# EAGLE design xmega32devboard (EAGLE 7.2.0)
CNAME: ATxmega32D4 Development Board; CREVISION: 0.2; DESIGNER: Dru / RNDC
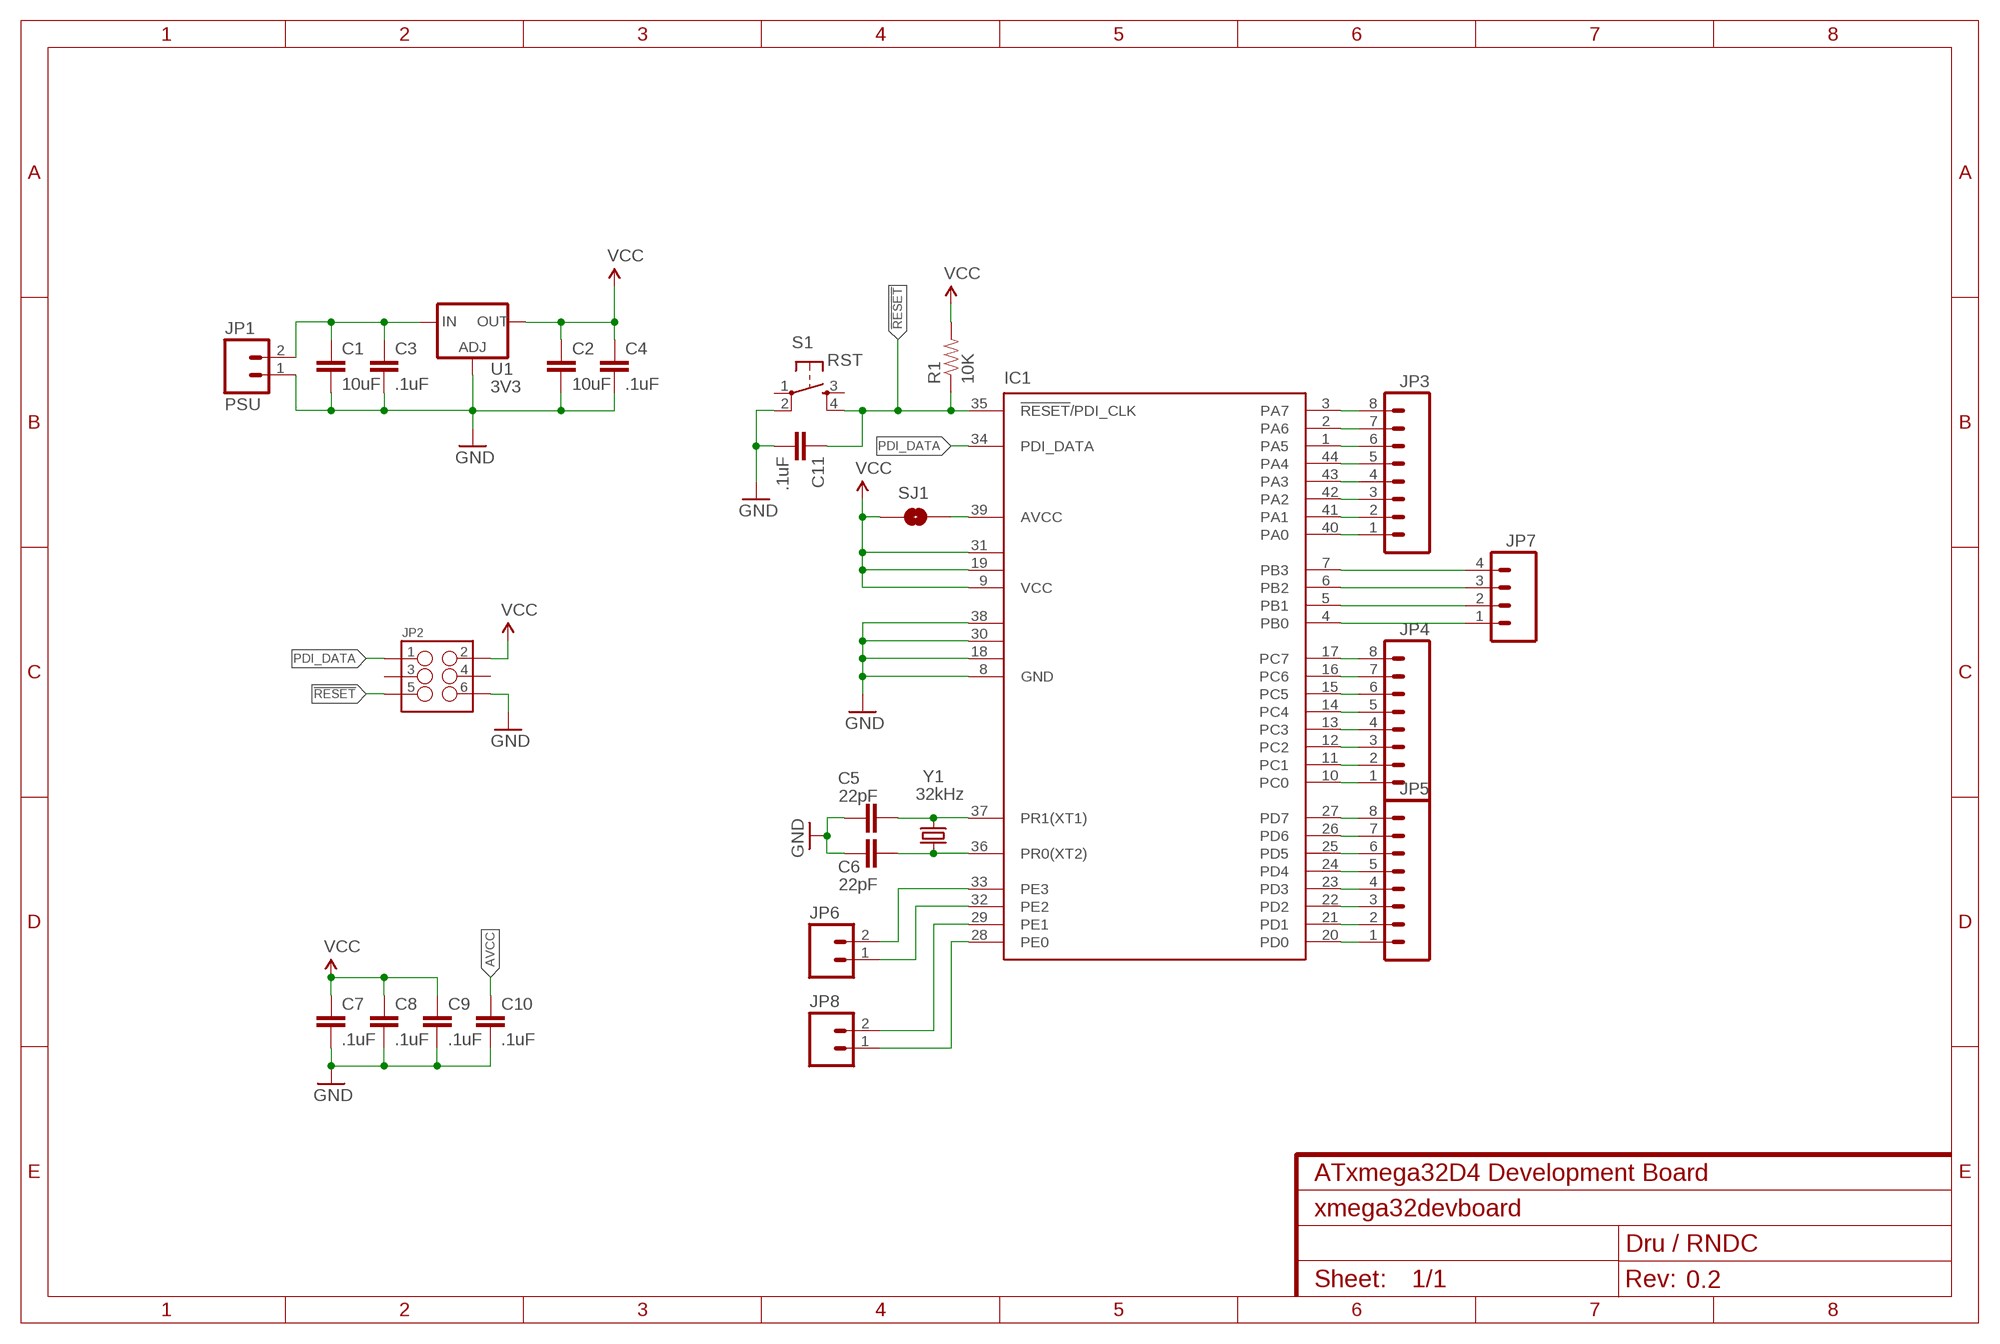
[diagram p0: schematic, sheet 1]

## Parts
C1  10uF  CAP0603-CAP  [0603-CAP]
C2  10uF  CAP0603-CAP  [0603-CAP]
C3  .1uF  CAP0805  [0805]
C4  .1uF  CAP0805  [0805]
C5  22pF  CAP0805  [0805]
C6  22pF  CAP0805  [0805]
C7  .1uF  CAP0805  [0805]
C8  .1uF  CAP0805  [0805]
C9  .1uF  CAP0805  [0805]
C10  .1uF  CAP0805  [0805]
C11  .1uF  CAP0805  [0805]
IC1  XMEGA16A4A  [TQFP44]
JP1  PSU  M02PTH  [1X02]
JP2  M03X2NO_SILK  [2X3-NS]
JP3  M081X08  [1X08]
JP4  M081X08  [1X08]
JP5  M081X08  [1X08]
JP6  M02PTH  [1X02]
JP7  M04PTH  [1X04]
JP8  M02PTH  [1X02]
R1  10K  RESISTOR0603-RES  [0603-RES]
S1  RST  TAC_SWITCHSMD  [TACTILE-SWITCH-SMD]
SJ1  JUMPER-PAD-2-NO  [PAD-JUMPER-2-NO_NO_SILK]
U1  3V3  V_REG_317SMD  [SOT223]
Y1  32kHz  CRYSTALTC38H  [TC38H]

## Nets
!RESET: C11.1 IC1.35(!RESET!/PDI_CLK) JP2.5 R1.1 S1.4
AVCC: C10.1 IC1.39(AVCC) SJ1.2
GND: C1.2 C2.2 C3.2 C4.2 C5.1 C6.1 C7.2 C8.2 C9.2 C10.2 C11.2 IC1.8(GND) IC1.18(GND1) IC1.30(GND2) IC1.38(GND3) JP1.1 JP2.6 S1.2 U1.1(ADJ)
N$1: C1.1 C3.1 JP1.2 U1.3(IN)
N$2: C6.2 IC1.36(PR0(XT2)) Y1.2
N$3: C5.2 IC1.37(PR1(XT1)) Y1.1
N$4: IC1.20(PD0) JP5.1
N$5: IC1.21(PD1) JP5.2
N$6: IC1.22(PD2) JP5.3
N$7: IC1.23(PD3) JP5.4
N$8: IC1.24(PD4) JP5.5
N$9: IC1.25(PD5) JP5.6
N$10: IC1.26(PD6) JP5.7
N$11: IC1.27(PD7) JP5.8
N$12: IC1.40(PA0) JP3.1
N$13: IC1.41(PA1) JP3.2
N$14: IC1.42(PA2) JP3.3
N$15: IC1.43(PA3) JP3.4
N$16: IC1.44(PA4) JP3.5
N$17: IC1.1(PA5) JP3.6
N$18: IC1.2(PA6) JP3.7
N$19: IC1.3(PA7) JP3.8
N$20: IC1.17(PC7) JP4.8
N$21: IC1.16(PC6) JP4.7
N$22: IC1.15(PC5) JP4.6
N$23: IC1.14(PC4) JP4.5
N$24: IC1.13(PC3) JP4.4
N$25: IC1.12(PC2) JP4.3
N$26: IC1.11(PC1) JP4.2
N$27: IC1.10(PC0) JP4.1
N$28: IC1.33(PE3) JP6.2
N$29: IC1.32(PE2) JP6.1
N$30: IC1.29(PE1) JP8.2
N$31: IC1.28(PE0) JP8.1
PB0: IC1.4(PB0) JP7.1
PB1: IC1.5(PB1) JP7.2
PB2: IC1.6(PB2) JP7.3
PB3: IC1.7(PB3) JP7.4
PDI_DATA: IC1.34(PDI_DATA) JP2.1
VCC: C2.1 C4.1 C7.1 C8.1 C9.1 IC1.9(VCC) IC1.19(VCC1) IC1.31(VCC2) JP2.2 R1.2 SJ1.1 U1.2(OUT)
Unconnected: JP2.3 JP2.4 S1.1 S1.3

## Library data of the parts
C1-C4 C7-C11 = SparkFun-Capacitors:CAP: Capacitor Standard 0603 ceramic capacitor, and 0.1" leaded capacitor.
C5 C6 = SparkFun-Passives:CAP: Capacitor Standard 0603 ceramic capacitor, and 0.1" leaded capacitor.
IC1 = atmel:XMEGA16A4: MICROCONTROLLER Features High-performance, Low-power 8/16-bit AVR XMEGA Microcontroller Non-Volatile Program and Data Memories - 16 KB - 128 KB of In-System Self-Programmable Flash - 4 KB - 8 KB Boot Code Section with Independent Lock Bits - 1 KB - 2 KB EEPROM - 2 KB - 8 KB Internal SRAM Peripheral Features - Four-channel DMA Controller with support for external requests - Eight-channel Event System - Five 16-bit Timer/Counters Three Timer/Counters with 4 Output Compare or Input Capture channels Two Timer/Counters with 2 Output Compare or Input Capture channels High-Resolution Extensions on all Timer/Counters Advanced Waveform Extension on one Timer/Counter - Five USARTs IrDA Extension on one USART - Two Two-Wire Interfaces with dual address match (I2C and SMBus compatible) - Two SPIs (Serial Peripheral Interfaces) peripherals - AES and DES Crypto Engine - 16-bit Real Time Counter with Separate Oscillator - One Twelve-channel, 12-bit, 2 Msps Analog to Digital Converter - One Two-channel, 12-bit, 1 Msps Digital to Analog Converter - Two Analog Comparators with Window compare function - External Interrupts on all General Purpose I/O pins - Programmable Watchdog Timer with Separate On-chip Ultra Low Power Oscillator Special Microcontroller Features - Power-on Reset and Programmable Brown-out Detection - Internal and External Clock Options with PLL - Programmable Multi-level Interrupt Controller - Sleep Modes: Idle, Power-down, Standby, Power-save, Extended Standby - Advanced Programming, Test and Debugging Interfaces PDI (Program and Debug Interface) for programming, test and debugging I/O and Packages - 34 Programmable I/O Lines - 44 - lead TQFP - 44 - pad VQFN/QFN - 49 - ball VFBGA Operating Voltage - 1.6 - 3.6V Speed performance - 0 - 12 MHz @ 1.6 - 3.6V - 0 - 32 MHz @ 2.7 - 3.6V Drawn by Dipl.-Ing. (FH) Robert Siegler Created: 27.05.09; OC_FARNELL: unknown; OC_NEWARK: unknown
JP1 JP6 JP8 = SparkFun-Connectors:M02: Standard 2-pin 0.1" header. Use with - straight break away headers ( PRT-00116) - right angle break away headers (PRT-00553) - swiss pins (PRT-00743) - machine pins (PRT-00117) - female headers (PRT-00115) Molex polarized connector foot print use with: PRT-08233 with associated crimp pins and housings. 2.54_SCREWTERM for use with PRT-10571. 3.5mm Screw Terminal footprints for PRT-08084 5mm Screw Terminal footprints for use with PRT-08432
JP2 = SparkFun-Connectors:M03X2: 2x3 .1" header. Shrouded, with keying- CONN-10681 SMT- CONN-11415 Pogo pins- HW-11044
JP3-JP5 = SparkFun-Connectors:M08: Header 8 Standard 8-pin 0.1" header. Use with straight break away headers (SKU : PRT-00116), right angle break away headers (PRT-00553), swiss pins (PRT-00743), machine pins (PRT-00117), and female headers (PRT-00115).
JP7 = SparkFun-Connectors:M04: Header 4 Standard 4-pin 0.1" header. Use with straight break away headers (SKU : PRT-00116), right angle break away headers (PRT-00553), swiss pins (PRT-00743), machine pins (PRT-00117), and female headers (PRT-00115). Molex polarized connector foot print use with SKU : PRT-08231 with associated crimp pins and housings. 1MM SMD Version SKU: PRT-10208
R1 = SparkFun-Passives:RESISTOR: Resistor Basic schematic elements and footprints for 0603, 1206, and PTH resistors.
S1 = SparkFun-Electromechanical:TAC_SWITCH: Momentary Switch Button commonly used for reset or general input. Spark Fun Electronics SKU : COM-00097 SMT- SWCH-08247; PROD_ID: SWCH-08247; VALUE: TAC_SWITCHSMD
SJ1 = SparkFun-Passives:JUMPER-PAD-2-NO
U1 = SparkFun-PowerIC:V_REG_317: Voltage Regulator Standard LM317 adjustable voltage regulator. AOI (Adjust Output Input). Google 'LM317 Calculator' for easy to use app to get the two resistor values needed. 240/720 for 5V output. 240/390 for 3.3V output. Spark Fun Electronics SKU : COM-00527
Y1 = SparkFun-FreqCtrl:CRYSTAL: Various standard crystals. Proven footprints. Spark Fun Electronics SKU : COM-00534

## Board
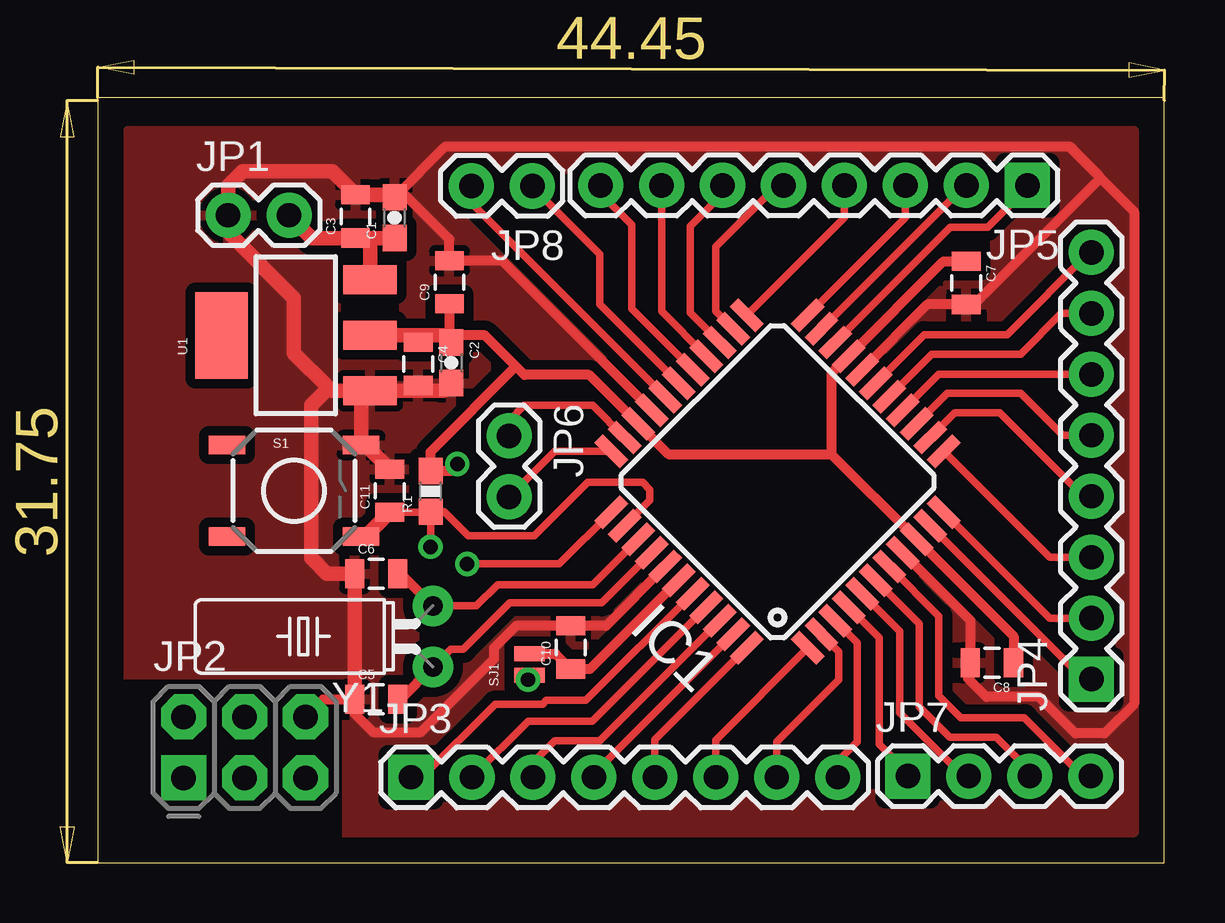
[diagram p1: board, top side]
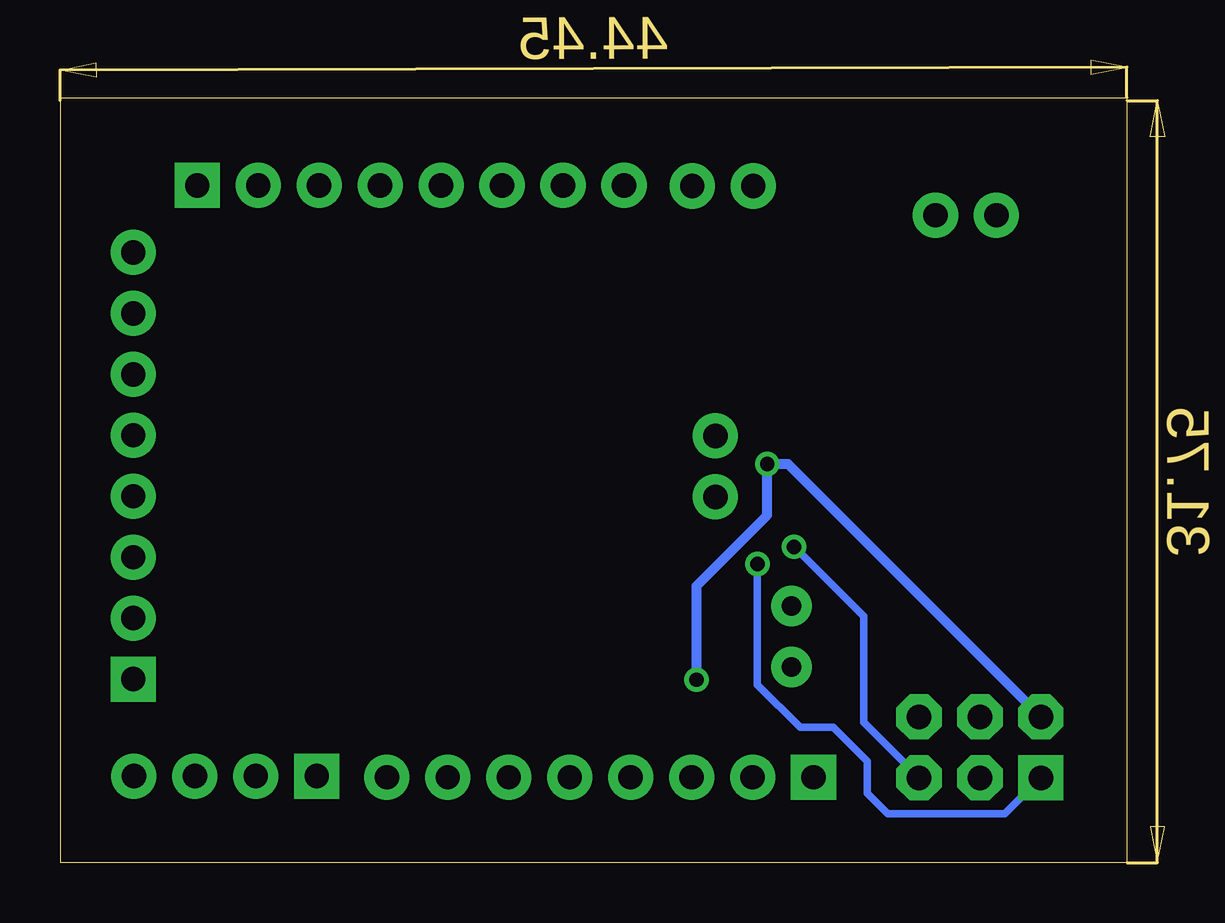
[diagram p2: board, bottom side, seen from below]

Size 44.43 x 31.88 mm. Coordinates in mm from the lower left corner, seen from the top.
Outline: 0,0 44.43,0 44.43,31.88 0,31.88 0,0
Copper layers (1*16): Top 0.035mm / dielectric 1.5mm / Bottom 0.035mm
Design rules "default *": minimum track width 10mil, minimum drill 24mil, track to track 16mil, track to pad 16mil, pad to pad 12mil, via to via 8mil, smd to smd 8mil, copper to edge 40mil, drill to drill 8mil, minimum pad ring 10mil, minimum via ring 8mil, stop-mask expansion 4mil, vias tented up to drill 0mil, thermal gap 10mil
tRestrict: area 1.3,1.3 to 10.2,7.6

### Footprints (pad centres in the part's own frame; a part is rotated, then mirrored left to right if it is on the bottom)
0603-CAP = smd 1.1 x 1: 1 -0.85,0; 2 0.85,0
0805 = smd 0.8 x 1.2: 1 -0.9,0; 2 0.9,0
TQFP44 = smd 1.5 x 0.5: 1 -5.8,4; 2 -5.8,3.2; 3 -5.8,2.4; 4 -5.8,1.6; 5 -5.8,0.8; 6 -5.8,0; 7 -5.8,-0.8; 8 -5.8,-1.6; 9 -5.8,-2.4; 10 -5.8,-3.2; 11 -5.8,-4; 23 5.8,-4; 24 5.8,-3.2; 25 5.8,-2.4; 26 5.8,-1.6; 27 5.8,-0.8; 28 5.8,0; 29 5.8,0.8; 30 5.8,1.6; 31 5.8,2.4; 32 5.8,3.2; 33 5.8,4 | smd 0.5 x 1.5: 12 -4,-5.8; 13 -3.2,-5.8; 14 -2.4,-5.8; 15 -1.6,-5.8; 16 -0.8,-5.8; 17 0,-5.8; 18 0.8,-5.8; 19 1.6,-5.8; 20 2.4,-5.8; 21 3.2,-5.8; 22 4,-5.8; 34 4,5.8; 35 3.2,5.8; 36 2.4,5.8; 37 1.6,5.8; 38 0.8,5.8; 39 0,5.8; 40 -0.8,5.8; 41 -1.6,5.8; 42 -2.4,5.8; 43 -3.2,5.8; 44 -4,5.8
1X02 = drill 1.016 pad 1.88: 1 0,0; 2 2.54,0
2X3-NS = drill 1.016 pad 1.88 square: 1 -2.54,-1.27 | drill 1.016 pad 1.88 octagon: 2 -2.54,1.27; 3 0,-1.27; 4 0,1.27; 5 2.54,-1.27; 6 2.54,1.27
1X08 = drill 1.016 pad 1.88 square: 1 0,0 | drill 1.016 pad 1.88: 2 2.54,0; 3 5.08,0; 4 7.62,0; 5 10.16,0; 6 12.7,0; 7 15.24,0; 8 17.78,0
1X04 = drill 1.016 pad 1.88 square: 1 0,0 | drill 1.016 pad 1.88: 2 2.54,0; 3 5.08,0; 4 7.62,0
0603-RES = smd 1.1 x 1: 1 -0.85,0; 2 0.85,0
TACTILE-SWITCH-SMD = smd 1.524 x 0.762: 1 -2.794,1.905; 2 2.794,1.905; 3 -2.794,-1.905; 4 2.794,-1.905
PAD-JUMPER-2-NO_NO_SILK = smd 0.635 x 1.27: 1 -0.45,0; 2 0.45,0
SOT223 = smd 1.219 x 2.235: 1 -2.311,-3.099; 2 0,-3.099; 3 2.311,-3.099 | smd 3.6 x 2.2: 4 0,3.099
TC38H = drill 0.813 pad 1.676: 1 -1.27,0; 2 1.27,0

### Placement (x,y rotation side)
C1  12.37,26.87 90 top
C2  14.73,20.83 270 top
C3  10.74,26.92 90 top
C4  13.36,20.78 270 top
C5  11.61,6.81 0 top
C6  11.61,12.04 0 top
C7  36.2,24.16 270 top
C8  37.26,8.33 180 top
C9  14.66,24.18 90 top
C10  19.71,8.97 90 top
C11  12.17,15.49 90 top
IC1  28.32,15.88 135 top
JP1  5.44,26.97 0 top
JP2  6.12,4.8 0 top
JP3  13.06,3.56 0 top
JP4  41.4,7.65 90 top
JP5  38.73,28.22 180 top
JP6  17.14,17.78 270 top
JP7  33.76,3.61 0 top
JP8  18.11,28.19 180 top
R1  13.87,15.47 90 top
S1  8.18,15.49 0 top
SJ1  17.98,8.26 90 top
U1  8.26,21.97 90 top
Y1  13.97,9.42 90 top

### Tracks (layer width: path | path; a pad name or v marks a point on that pad's centre or on a via)
!RESET  (via drill 0.6 pad 0.41)
  Top 0.305: C11.1 13.84,14.59 R1.1 | IC1.35 23.01,15.09 23.01,15.54 22.71,15.85 20.42,15.85 18.19,13.61 15.44,13.61 14.44,14.62 R1.1 | v13.87,13.16 R1.1
  Top 0.61: S1.4 11.16,13.59 C11.1
  Bottom 0.305: JP2.5 10.97,5.84 10.97,10.26 v13.87,13.16
AVCC
  Top 0.406: IC1.39 20.51,8.07 C10.1 19.07,8.71 SJ1.2
GND
  Top 0.406: IC1.30 16.85,25.08 C9.2 14.66,25.98 12.7,27.94 12.59,27.94 C1.2 14.47,29.82 40.54,29.82 40.54,29.77 | IC1.38 21.18,9.87 C10.2 17.43,9.87 16.51,8.94 16.51,8.48 13.46,5.44 11.48,5.44 10.71,6.21 C5.1 9.4,6.81 JP2.6 | IC1.18 34.57,23.25 C7.2 36.51,23.25 41.71,28.45 41.71,28.65 40.59,29.77 40.54,29.77 | IC1.8 36.36,10.1 C8.2 36.27,8.24 36.27,7.67 37.03,6.91 39.22,6.91 40.74,5.38 41.96,5.38 43.18,6.6 43.18,27.13 40.54,29.77
  Top 0.61: U1.1 9.75,19.66 9.63,19.79 | 9.63,19.79 8.18,21.23 8.18,23.52 5.33,26.36 5.33,26.87 JP1.1 5.44,28.19 6.04,28.8 9.77,28.8 C3.2 12.27,27.82 C1.2 | U1.1 13.46,19.66 | 13.46,19.66 14.41,19.66 C2.2 | C4.2 13.36,19.76 13.46,19.66 | U1.1 10.97,19.28 S1.2 11.16,17.4 C11.2 | C5.1 C6.1 9.55,12.04 8.89,12.7 8.89,19.05 9.63,19.79
  pour Top: 1.27,1.27 43.18,1.27 43.18,30.48 1.27,30.48
N$1
  Top 0.61: 11.43,26.02 C3.1 8.93,26.02 JP1.2 | 11.43,26.02 C1.1 | U1.3 11.35,25.95 11.43,26.02
N$2
  Top 0.305: C6.2 12.62,12.04 | IC1.36 20.63,11.58 16.66,11.58 15.77,10.69 Y1.2
  Top 0.406: 12.62,12.04 Y1.2
N$3
  Top 0.305: C5.2 12.62,6.81 | IC1.37 21,10.82 17.17,10.82 15.24,8.89 14.71,8.89 Y1.1
  Top 0.406: 12.62,6.81 Y1.1
N$4
  Top 0.305: IC1.20 35.52,26.47 37.08,26.47 38.73,28.12 JP5.1
N$5
  Top 0.305: IC1.21 36.14,28.22 JP5.2
N$6
  Top 0.305: IC1.22 33.66,26.87 JP5.3
N$7
  Top 0.305: IC1.23 31.11,26.87 JP5.4
N$8
  Top 0.305: IC1.24 25.76,22.97 25.76,25.65 28.32,28.22 JP5.5
N$9
  Top 0.305: IC1.25 24.69,22.9 24.69,26.52 26.04,27.86 JP5.6
N$10
  Top 0.305: IC1.26 23.5,22.96 JP5.7
N$11
  Top 0.305: IC1.27 22.25,23.08 22.25,26.57 20.95,27.86 JP5.8
N$12
  Top 0.305: IC1.40 20.33,6.76 18.69,6.76 18.54,6.6 16.56,6.6 13.51,3.56 JP3.1
N$13
  Top 0.305: IC1.41 20.6,5.89 17.93,5.89 JP3.2
N$14
  Top 0.305: IC1.42 20.92,5.08 19.05,5.08 18.14,4.17 JP3.3
N$15
  Top 0.305: IC1.43 20.68,3.7 JP3.4
N$16
  Top 0.305: IC1.44 23.22,5.11 JP3.5
N$17
  Top 0.305: IC1.1 25.76,5.11 JP3.6
N$18
  Top 0.305: IC1.2 30.89,8.78 30.89,7.62 28.3,5.03 JP3.7
N$19
  Top 0.305: IC1.3 31.65,9.15 31.65,5.03 30.84,4.22 JP3.8
N$20
  Top 0.305: IC1.17 34.44,22 37.9,22 41.33,25.43 JP4.8
N$21
  Top 0.305: IC1.16 34.76,21.18 38.46,21.18 40.16,22.89 JP4.7
N$22
  Top 0.305: IC1.15 35.05,20.34 JP4.6
N$23
  Top 0.305: IC1.14 35.4,19.56 38.46,19.56 40.21,17.8 JP4.5
N$24
  Top 0.305: IC1.13 35.72,18.75 37.59,18.75 41.07,15.27 JP4.4
N$25
  Top 0.305: IC1.12 39.67,12.72 JP4.3
N$26
  Top 0.305: IC1.11 39.67,10.19 JP4.2
N$27
  Top 0.305: IC1.10 41.08,7.64 JP4.1
N$28
  Top 0.305: JP6.2 19.05,17.15 IC1.33
N$29
  Top 0.305: IC1.32 20.62,19.05 17.78,19.05 17.14,18.41 JP6.1
N$30
  Top 0.305: IC1.29 15.57,27.49 JP8.2
N$31
  Top 0.305: IC1.28 20.93,23.27 20.93,25.35 18.11,28.17 JP8.1
PB0
  Top 0.305: IC1.4 32.56,9.37 32.56,4.93 33.76,3.73 JP7.1
PB1
  Top 0.305: IC1.5 33.43,9.64 33.43,6.25 36.07,3.61 JP7.2
PB2
  Top 0.305: IC1.6 34.24,9.96 34.24,6.5 35.51,5.23 37.44,5.23 38.84,3.83 JP7.3
PB3
  Top 0.305: IC1.7 35.05,10.28 35.05,6.96 35.97,6.04 38.61,6.04 41.05,3.61 JP7.4
PDI_DATA  (via drill 0.6 pad 0.41)
  Top 0.305: IC1.34 19.23,12.45 v15.39,12.45
  Bottom 0.305: v15.39,12.45 15.39,7.42 13.61,5.64 12.24,5.64 10.82,4.22 10.82,2.9 9.96,2.03 5.08,2.03 JP2.1
VCC  (via drill 0.6 pad 0.41)
  Top 0.305: 14.66,21.75 C2.1
  Top 0.406: C9.1 14.66,21.75 | 17.42,20.68 17.78,20.32 20.48,20.32 IC1.31 23.78,17.02 30.57,17.02 | 17.42,20.68 16.13,21.97 13.97,21.97 | 17.42,20.68 13.87,17.12 R1.2 14.69,16.32 v14.99,16.61 | 30.57,17.02 IC1.9 38.16,9.43 C8.1 | 30.57,17.02 30.57,20.39 IC1.19 35.24,25.05 C7.1 | SJ1.1 17.98,7.67 v17.93,7.62
  Top 0.61: U1.2 13.41,21.97 | 13.41,21.97 13.97,21.97 14.44,21.97 C2.1 | C4.1 13.36,21.92 13.41,21.97
  Bottom 0.406: JP2.2 14.12,16.61 v14.99,16.61 14.99,14.48 17.93,11.53 v17.93,7.62